# Altium schematic sheet Sheet3.SchDoc
size A
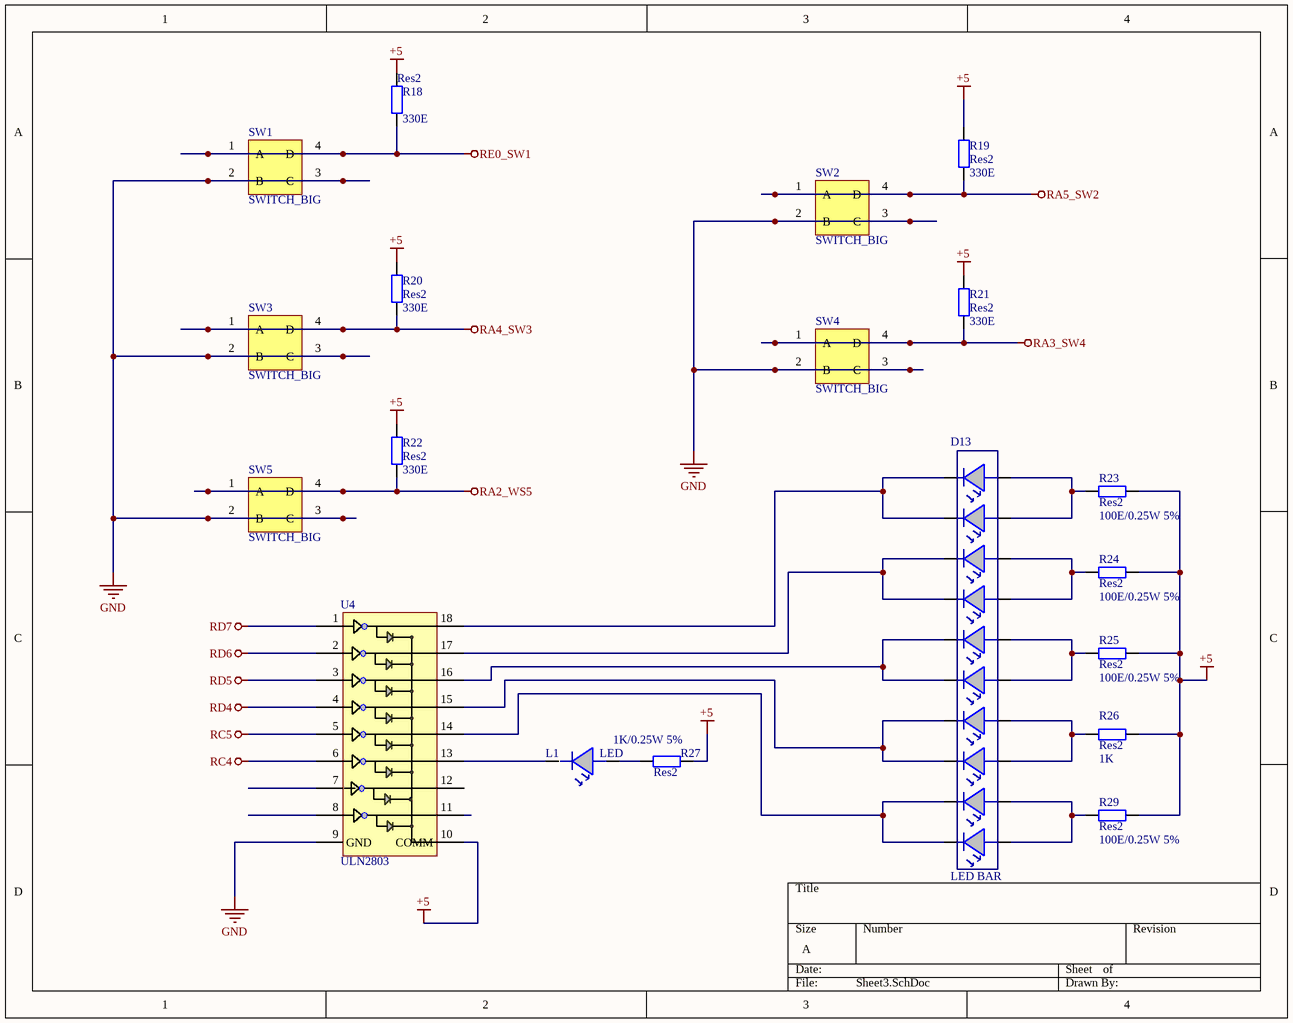
[diagram p0: Sheet3.SchDoc]

## Parts
D13  LED BAR  [LED_BAR]
L1  LED  [LED5MM]
R18  Res2  value 330E  [AXIAL-0.4]
R19  Res2  value 330E  [AXIAL-0.4]
R20  Res2  value 330E  [AXIAL-0.4]
R21  Res2  value 330E  [AXIAL-0.4]
R22  Res2  value 330E  [AXIAL-0.4]
R23  Res2  value 100E/0.25W 5%  [AXIAL-0.4]
R24  Res2  value 100E/0.25W 5%  [AXIAL-0.4]
R25  Res2  value 100E/0.25W 5%  [AXIAL-0.4]
R26  Res2  value 1K  [AXIAL-0.4]
R27  Res2  value 1K/0.25W 5%  [AXIAL-0.4]
R29  Res2  value 100E/0.25W 5%  [AXIAL-0.4]
SW1  SWITCH_BIG  [SWITCH - BIG]
SW2  SWITCH_BIG  [SWITCH - BIG]
SW3  SWITCH_BIG  [SWITCH - BIG]
SW4  SWITCH_BIG  [SWITCH - BIG]
SW5  SWITCH_BIG  [SWITCH - BIG]
U4  ULN2803  [ULN2803]

## Nets
+5: R18.2 R19.2 R20.2 R21.2 R22.2 R23.2 R24.2 R25.2 R26.2 R27.1 R29.2 U4.10(COMM)
GND: SW1.2(B) SW1.3(C) SW2.2(B) SW2.3(C) SW3.2(B) SW3.3(C) SW4.2(B) SW4.3(C) SW5.2(B) SW5.3(C) U4.9(GND)
RA2_WS5: R22.1 SW5.1(A) SW5.4(D)
RA3_SW4: R21.1 SW4.1(A) SW4.4(D)
RA4_SW3: R20.1 SW3.1(A) SW3.4(D)
RA5_SW2: R19.1 SW2.1(A) SW2.4(D)
RC4: U4.6
RC5: U4.5
RD4: U4.4
RD5: U4.3
RD6: U4.2
RD7: U4.1
RE0_SW1: R18.1 SW1.1(A) SW1.4(D)
NetD13_1: D13.1 D13.2 R29.1
NetD13_3: D13.3 D13.4 R26.1
NetD13_5: D13.5 D13.6 R25.1
NetD13_7: D13.7 D13.8 R24.1
NetD13_9: D13.9 D13.10 R23.1
NetD13_11: D13.11 D13.12 U4.18
NetD13_13: D13.13 D13.14 U4.17
NetD13_15: D13.15 D13.16 U4.16
NetD13_17: D13.17 D13.18 U4.15
NetD13_19: D13.19 D13.20 U4.14
NetL1_1: L1.1(A) R27.2
NetL1_2: L1.2(B) U4.13

Not connected (* = marked no-connect by the designer): U4 7 8 11 12

## Library data of the parts
D13 = LED_BAR
L1 = LED_5MM
R18-R27 R29 = Res2: Resistor; Published: 8-Jun-2000; LatestRevisionDate: 17-Jul-2002; LatestRevisionNote: Re-released for DXP Platform.; PackageReference: AXIAL-0.4; Publisher: Altium Limited; PackageDescription: Axial Device, Thru-Hole; 2 Leads; 0.4 in Pin Spacing
SW1-SW5 = SWITCH_BIG: Big size
U4 = ULN2803: 􀃯voltage,  high􀃯current darlington drivers comprised of eight NPN  darlington pairs.  All units feature integral clamp diodes for